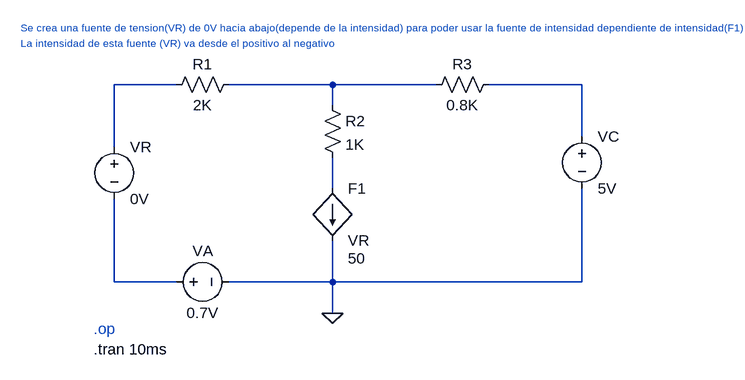
[diagram p0: schematic ProblemaResuelto.asc]
ProblemaResuelto.asc, the LTspice schematic file:
Version 4
SHEET 1 924 680
WIRE 0 32 -96 32
WIRE 240 32 80 32
WIRE 400 32 240 32
WIRE 624 32 480 32
WIRE 240 64 240 32
WIRE 624 112 624 32
WIRE -96 128 -96 32
WIRE 240 192 240 144
WIRE -96 336 -96 208
WIRE 0 336 -96 336
WIRE 240 336 240 272
WIRE 240 336 80 336
WIRE 624 336 624 192
WIRE 624 336 240 336
WIRE 240 384 240 336
FLAG 240 384 0
SYMBOL res 224 48 R0
SYMATTR InstName R2
SYMATTR Value 1K
SYMBOL res 96 16 R90
WINDOW 0 0 56 VBottom 2
WINDOW 3 32 56 VTop 2
SYMATTR InstName R1
SYMATTR Value 2K
SYMBOL res 496 16 R90
WINDOW 0 0 56 VBottom 2
WINDOW 3 32 56 VTop 2
SYMATTR InstName R3
SYMATTR Value 0.8K
SYMBOL voltage -16 336 R270
WINDOW 0 32 56 VTop 2
WINDOW 3 -32 56 VBottom 2
WINDOW 123 0 0 Left 0
WINDOW 39 0 0 Left 0
SYMATTR InstName VA
SYMATTR Value 0.7V
SYMBOL voltage 624 96 R0
WINDOW 123 0 0 Left 0
WINDOW 39 0 0 Left 0
SYMATTR InstName VC
SYMATTR Value 5V
SYMBOL f 240 192 R0
WINDOW 123 24 108 Left 2
SYMATTR Value2 50
SYMATTR InstName F1
SYMATTR Value VR
SYMBOL voltage -96 112 R0
WINDOW 123 0 0 Left 0
WINDOW 39 0 0 Left 0
SYMATTR InstName VR
SYMATTR Value 0V
TEXT -128 408 Left 2 ;.op
TEXT -240 -56 Left 1 ;Se crea una fuente de tension(VR) de 0V hacia abajo(depende de la intensidad) para poder usar la fuente de intensidad dependiente de intensidad(F1)
TEXT -128 440 Left 2 !.tran 10ms
TEXT -240 -32 Left 1 ;La intensidad de esta fuente (VR) va desde el positivo al negativo

The netlist it stands for:
* ProblemaResuelto.asc
R2 N002 N004 1K
R1 N002 N001 2K
R3 N003 N002 0.8K
VA N005 0 0.7V
VC N003 0 5V
F1 N004 0 VR 50
VR N001 N005 0V
* .op
* Se crea una fuente de tension(VR) de 0V hacia abajo(depende de la intensidad) para poder usar la fuente de intensidad dependiente de intensidad(F1)
.tran 10ms
* La intensidad de esta fuente (VR) va desde el positivo al negativo
.backanno
.end